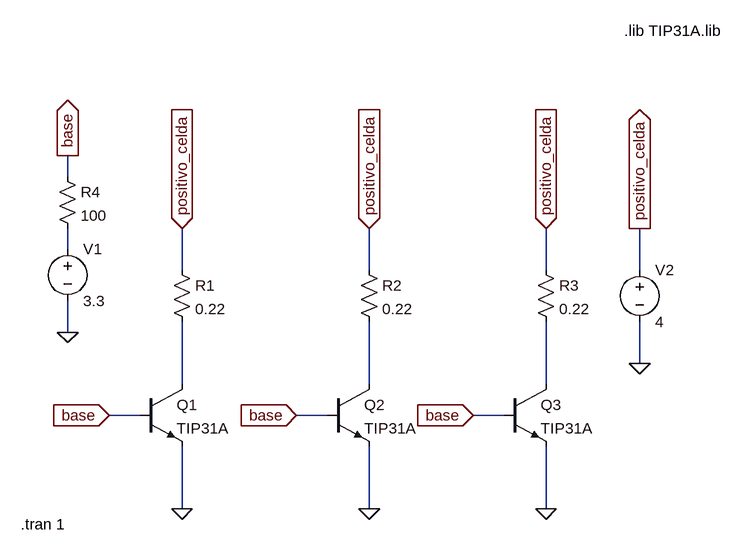
[diagram p0: schematic circuito_de_descarga.asc]
circuito_de_descarga.asc, the LTspice schematic file:
Version 4
SHEET 1 1152 680
WIRE 0 -224 0 -256
WIRE 0 -112 0 -144
WIRE 176 -80 176 -144
WIRE 464 -80 464 -144
WIRE 736 -80 736 -144
WIRE 880 -80 880 -144
WIRE 0 16 0 -32
WIRE 880 64 880 0
WIRE 176 96 176 0
WIRE 464 96 464 0
WIRE 736 96 736 0
WIRE 112 144 64 144
WIRE 400 144 352 144
WIRE 672 144 624 144
WIRE 176 288 176 192
WIRE 464 288 464 192
WIRE 736 288 736 192
FLAG 176 288 0
FLAG 64 144 base
IOPIN 64 144 In
FLAG 176 -144 positivo_celda
IOPIN 176 -144 In
FLAG 464 288 0
FLAG 352 144 base
IOPIN 352 144 In
FLAG 464 -144 positivo_celda
IOPIN 464 -144 In
FLAG 736 288 0
FLAG 624 144 base
IOPIN 624 144 In
FLAG 736 -144 positivo_celda
IOPIN 736 -144 In
FLAG 0 -256 base
IOPIN 0 -256 Out
FLAG 0 16 0
FLAG 880 -144 positivo_celda
IOPIN 880 -144 Out
FLAG 880 64 0
SYMBOL npn 112 96 R0
SYMATTR InstName Q1
SYMATTR Value TIP31A
SYMBOL res 160 -96 R0
SYMATTR InstName R1
SYMATTR Value 0.22
SYMBOL npn 400 96 R0
SYMATTR InstName Q2
SYMATTR Value TIP31A
SYMBOL res 448 -96 R0
SYMATTR InstName R2
SYMATTR Value 0.22
SYMBOL npn 672 96 R0
SYMATTR InstName Q3
SYMATTR Value TIP31A
SYMBOL res 720 -96 R0
SYMATTR InstName R3
SYMATTR Value 0.22
SYMBOL voltage 0 -128 R0
WINDOW 123 0 0 Left 0
WINDOW 39 0 0 Left 0
SYMATTR InstName V1
SYMATTR Value 3.3
SYMBOL res -16 -240 R0
SYMATTR InstName R4
SYMATTR Value 100
SYMBOL voltage 880 -96 R0
WINDOW 123 0 0 Left 0
WINDOW 39 0 0 Left 0
SYMATTR InstName V2
SYMATTR Value 4
TEXT 856 -448 Left 2 !.lib TIP31A.lib
TEXT -72 312 Left 2 !.tran 1

The netlist it stands for:
* circuito_de_descarga.asc
Q1 N002 base 0 0 TIP31A
R1 positivo_celda N002 0.22
Q2 N003 base 0 0 TIP31A
R2 positivo_celda N003 0.22
Q3 N004 base 0 0 TIP31A
R3 positivo_celda N004 0.22
V1 N001 0 3.3
R4 base N001 100
V2 positivo_celda 0 4
.model NPN NPN
.model PNP PNP
.lib standard.bjt
.lib TIP31A.lib
.tran 1
.backanno
.end